# EAGLE design LTC3108breakoutDFN (EAGLE 5.10)
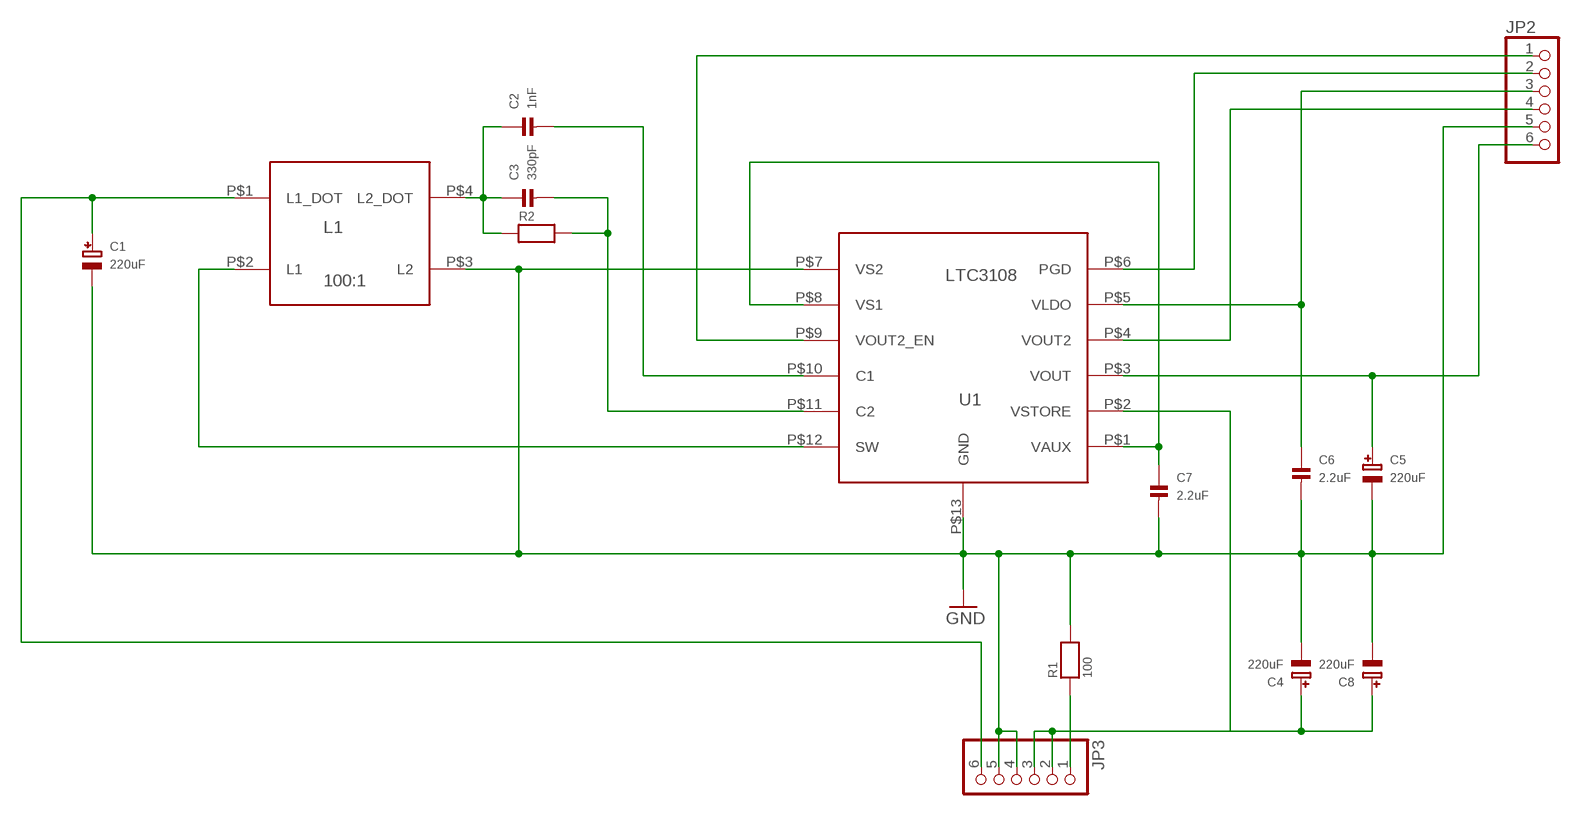
[diagram p0: schematic, sheet 1]

## Parts
C1  220uF  CAP_TANTALUMD/7343_REFLOW  [EIA7343-31/D-R]
C2  1nF  CAP_CERAMIC0603  [0603]
C3  330pF  CAP_CERAMIC0603  [0603]
C4  220uF  CAP_TANTALUMD/7343_REFLOW  [EIA7343-31/D-R]
C5  220uF  CAP_TANTALUMD/7343_REFLOW  [EIA7343-31/D-R]
C6  2.2uF  CAP_CERAMIC0603  [0603]
C7  2.2uF  CAP_CERAMIC0603  [0603]
C8  220uF  CAP_TANTALUMD/7343_REFLOW  [EIA7343-31/D-R]
JP2  HEADER-1X6ROUND  [1X06_ROUND]
JP3  HEADER-1X6ROUND  [1X06_ROUND]
L1  100:1  COILCRAFT_LPR6235-752SML  [COILCRAFT_LPR6235]
R1  100  RESISTOR0603  [0603]
R2  RESISTOR0603  [0603]
U1  LTC3108  [DFN_12]

## Nets
GND: C1.- C4.- C5.- C6.2 C7.2 C8.- JP2.5 JP3.4 JP3.5 L1.P$3(L2) R1.2 U1.P$7(VS2) U1.P$13(GND)
N$1: C1.+ JP3.6 L1.P$1(L1_DOT)
N$2: L1.P$2(L1) U1.P$12(SW)
N$3: C3.2 R2.2 U1.P$11(C2)
N$4: C2.2 U1.P$10(C1)
N$5: C2.1 C3.1 L1.P$4(L2_DOT) R2.1
N$6: C7.1 U1.P$1(VAUX) U1.P$8(VS1)
N$7: C4.+ C8.+ JP3.2 JP3.3 U1.P$2(VSTORE)
N$8: C5.+ JP2.6 U1.P$3(VOUT)
N$9: JP3.1 R1.1
N$10: C6.1 JP2.3 U1.P$5(VLDO)
N$11: JP2.1 U1.P$9(VOUT2_EN)
N$12: JP2.2 U1.P$6(PGD)
N$13: JP2.4 U1.P$4(VOUT2)

## Library data of the parts
C1 C4 C5 C8 = microbuilder:CAP_TANTALUM: Tantalum Capacitors Wave footprints have larger pads and are meant to be used for hand soldering. Reflow footprints are optimised for solder paste and a reflow oven. EIA3216-18/A-[R/W] - Size A / 3216-18 / 1206 footprint 4.7µF 25V 10% Tantalum Capacitor 10µF 16V 10% Tantalum Capacitor [Digikey: 495-2236-2-ND] EIA3528-21/B-[R/W] - Size B / 3528-21 47µF 10V 10% Tantalum Capactior [Digikey: 495-2216-1-ND] EIA6032-28/C-[R/W] - Size C / 6032-28 10µF 35V 20% Tantalum Capacitor [Digikey: 495-2285-1-ND] 100µF 16V 10% Tantalum Capactior [Digikey: 399-5214-1-ND]
C2 C3 C6 C7 = microbuilder:CAP_CERAMIC: Ceramic Capacitors 0402 - 0402 Surface Mount Capacitors 0.1uF 10V 10% [Digikey: 490-1318-2-ND] 0603 - 0603 Surface Mount Capacitors 16 pF 50V 5% [Digikey: 445-5051-2-ND] 22 pF 50V [Digikey: PCC220ACVTR-ND] 33 pF 50V 5% [Digikey: 490-1415-1-ND] 56pF 50V 5% [Digikey: 490-1421-1-ND] 220pF 50V 5% [Digikey: 445-1285-1-ND] 680 pF 50V 2200 pF 50V 5% C0G [Digikey: 445-1297-1-ND] 5600 pF 100V 5% X7R [Digikey: 478-3711-1-ND] 0.1 µF 25V 10% [Digikey: PCC2277TR-ND] 0.22 µF 16V 10% X7R [Digikey: 445-1318-1-ND] 1.0 µF 25V 10% [Digikey: 445-5146-2-ND] 0603 - RF Specific 3pF 250V +/-0.1pF RF [Digikey: 712-1347-1-ND] 18 pF 250V 5% [Digikey: 478-3505-1-ND or 712-1322-1-ND] 56 pF 250V 5% C0G RF [Digikey: 490-4867-1-ND] 68 pF 250V RF [Digikey: 490-4868-1-ND] 0805 - 0805 Surface Mount Capacitors 220 pF 250V 2% RF Ceramic Capacitor [Digikey: 712-1398-1-ND] 1000 pF 50V 2% NP0 Ceramic Capacitor [Digikey: 478-3760-1-ND] 0.1 µF 25V 10% Ceramic Capacitor [Digikey: PCC1828TR-ND] 1.0 µF 16V 10% Ceramic Capacitor[Digikey: 490-1691-2-ND] 10.0 µF 10V 10% Ceramic Capacitor[Digikey: 709-1228-1-ND] 1206 - 1206 Surface Mount Capacitors
JP2 JP3 = microbuilder:HEADER-1X6: PIN HEADER
L1 = wa7iut:COILCRAFT_LPR6235-752SML: Coil Craft LPR6235-752SML
R1 R2 = microbuilder:RESISTOR: Resistors 0402 - 0402 Surface Mount Package 10.0K 1% 1/16W [Digikey: 311-10.0KLRTR-ND] 0603 - 0603 Surface Mount Package 0 Ohm 1/10 Watt 1% Resistor 15 Ohm 1/10 Watt 1% Resistor 33 Ohm 1/10 Watt 1% Resistor 49.9 Ohm 1/10 Watt 1% Resistor 100 Ohm 1/10 Watt 1% Resistor 150 Ohm 1/10 Watt 1% Resistor 240 Ohm 1/10 Watt 1% Resistor 390 Ohm 1/10 Watt 1% Resistor 560 Ohm 1/10 Watt 1% Resistor 750 Ohm 1/10 Watt 1% Resistor 1.0K Ohm 1/10 Watt 1% Resistor 1.5K Ohm 1/10 Watt 1% Resistor 2.0K Ohm 1/10 Watt 1% Resistor 4.7K Ohm 1/10 Watt 1% Resistor 10.0K Ohm 1/10 Watt 1% Resistor 20.0K Ohm 1/10 Watt 1% Resistor 33.0K Ohm 1/10 Watt 1% Resistor 100.0K Ohm 1/10 Watt 1% Resistor 0805 - 0805 Surface Mount Package 0 Ohm 1/8 Watt 1% Resistor 33 Ohm 1/8 Watt 1% Resistor 100 Ohm 1/8 Watt 1% Resistor 150 Ohm 1/8 Watt 1% Resistor 200 Ohm 1/8 Watt 1% Resistor 240 Ohm 1/8 Watt 1% Resistor 330 Ohm 1/8 Watt 1% Resistor 390 Ohm 1/8 Watt 1% Resistor 470 Ohm 1/8 Watt 1% Resistor 1.0K Ohm 1/8 Watt 1% Resistor 1.5K Ohm 1/8 Watt 1% Resistor 2.0K Ohm 1/8 Watt 1% Resistor 4.7K Ohm 1/8 Watt 1% Resistor 5.1K Ohm 1/8 Watt 1% Resistor 5.6K Ohm 1/8 Watt 1% Resistor 10.0K Ohm 1/8 Watt 1% Resistor 22.0K Ohm 1/8 Watt 1% Resistor 33.0K Ohm 1/8 Watt 1% Resistor 100K Ohm 1/8 Watt 1% Resistor 1206 - 1206 Surface Mount Package
U1 = wa7iut:LTC3108: LTC3108 - Ultralow Voltage Step-Up Converter and Power Manager

## Board
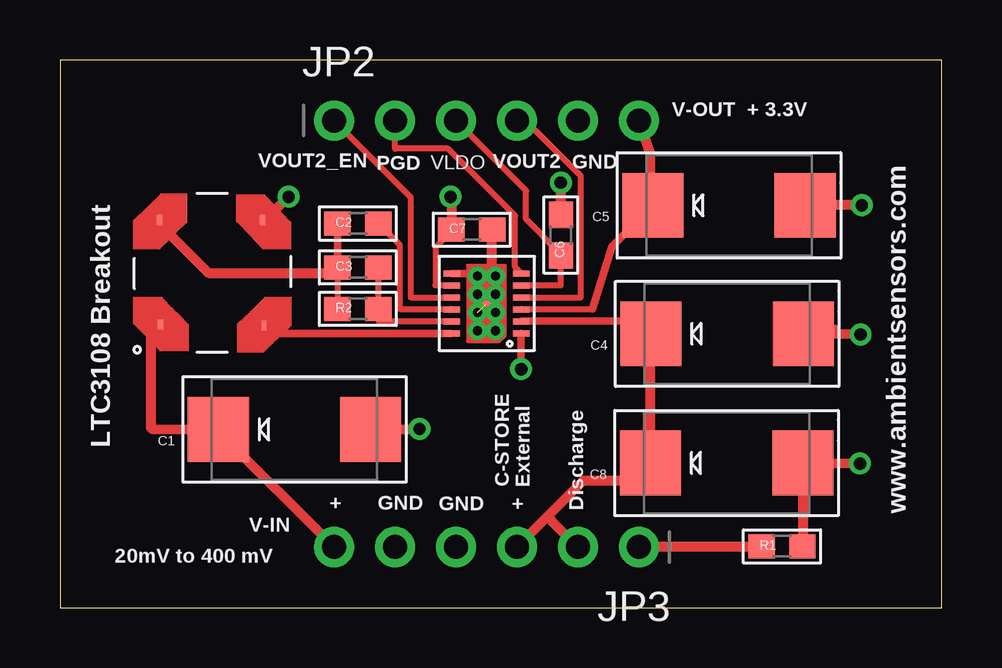
[diagram p1: board, top side]
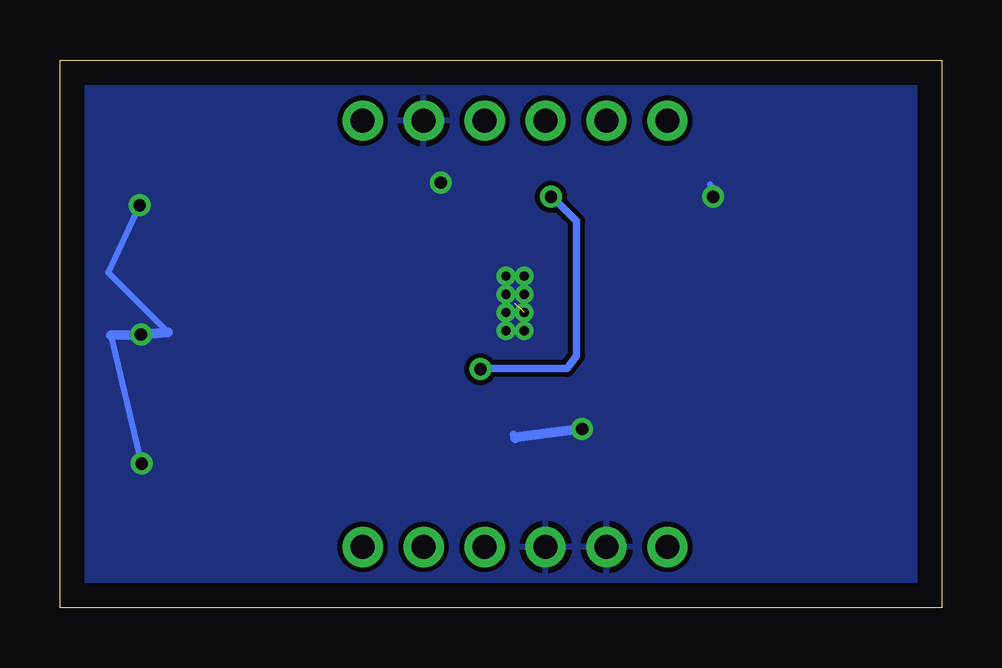
[diagram p2: board, bottom side, seen from below]

Size 36.75 x 22.85 mm. Coordinates in mm from the lower left corner, seen from the top.
Outline: 0,0 36.75,0 36.75,22.85 0,22.85 0,0
Copper layers (1*16): Top 0.035mm / dielectric 1.5mm / Bottom 0.035mm
Design rules "default": minimum track width 10mil, minimum drill 24mil, track to track 8mil, track to pad 8mil, pad to pad 8mil, via to via 8mil, smd to smd 8mil, copper to edge 40mil, drill to drill 8mil, minimum pad ring 10mil, minimum via ring 8mil, stop-mask expansion 4mil, vias tented up to drill 0mil, thermal gap 10mil

### Footprints (pad centres in the part's own frame; a part is rotated, then mirrored left to right if it is on the bottom)
EIA7343-31/D-R = smd 2.55 x 2.7: + 3.175,0; - -3.175,0
0603 = smd 1.1 x 1: 1 -0.85,0; 2 0.85,0
1X06_ROUND = drill 1 pad 1.676 round: 1 -6.35,0; 2 -3.81,0; 3 -1.27,0; 4 1.27,0; 5 3.81,0; 6 6.35,0
COILCRAFT_LPR6235 = smd 0.406 x 0.203: P$1 -2.15,2.15; P$2 -2.2,-2.15; P$3 2.2,-2.1; P$4 2.2,2.2
DFN_12 = smd 0.25 x 0.7: P$1 -1.25,-1.45; P$2 -0.75,-1.45; P$3 -0.25,-1.45; P$4 0.25,-1.445; P$5 0.75,-1.45; P$6 1.25,-1.45; P$7 1.25,1.45; P$8 0.75,1.45; P$9 0.25,1.45; P$10 -0.25,1.45; P$11 -0.75,1.45; P$12 -1.25,1.45; P$13 0,0

### Placement (x,y rotation side)
C1  9.78,7.44 180 top
C2  12.42,16.03 0 top
C3  12.42,14.2 0 top
C4  27.81,11.43 180 top
C5  27.89,16.79 180 top
C6  20.88,15.54 90 top
C7  17.17,15.77 0 top
C8  27.79,6.05 180 top
JP2  17.78,20.32 0 top
JP3  17.78,2.54 180 top
L1  6.35,13.97 90 top
R1  30.1,2.57 0 top
R2  12.42,12.47 0 top
U1  17.78,12.7 90 top

### Tracks (layer width: path | path; a pad name or v marks a point on that pad's centre or on a via)
GND  (via drill 0.38, 0.51)  (1 unrouted)
  Top 0.254: L1.P$3 8.55,16.17 | 17.29,13.95 v17.4,13.84 | v18.16,13.84 18.02,13.98 | v14.99,7.47 15.06,7.67 | 30.99,2.59 30.96,2.56 R1.2 | 30.99,5.84 C8.-
  Top 0.305: U1.P$7 17.29,13.95
  Top 0.406: 8.55,16.17 v9.53,17.14 | 18.02,13.98 C7.2 | C1.- v14.99,7.47 | C6.2 v20.88,17.73 | 32.31,11.61 C4.- v33.38,11.4 | C8.- v33.35,6.02 | v33.43,16.79 C5.- | 30.99,2.59 30.99,5.84
  Bottom 0.254: v9.53,17.14 9.53,17.53 9.65,17.65 | v33.35,6.02 34.62,11.38 | v33.43,16.79 34.75,13.99 32.26,11.51
  Bottom 0.305: 17.74,7.11 17.86,7.23
  Bottom 0.406: v14.99,7.47 17.74,7.11 17.78,7.07 | 34.62,11.38 v33.38,11.4 32.26,11.51
  other vias: 17.4,13.08 18.16,13.08 17.4,12.32 18.16,12.32 17.4,11.56 18.16,11.56
  pour Bottom: 0,22.86 0,0 36.83,0 36.83,22.86
N$1
  Top 0.254: C1.+ 6.71,7.26
  Top 0.406: L1.P$1 4.2,11.77 3.81,11.38 3.81,7.47 C1.+ | 6.71,7.26 JP3.6
N$2
  Top 0.254: L1.P$2 8.82,11.45
  Top 0.305: 8.82,11.45 U1.P$12
N$3
  Top 0.254: U1.P$11 16.31,11.96 13.28,11.96 13.28,12.47 R2.2 13.28,12.57 13.28,14.2 C3.2
N$4
  Top 0.254: U1.P$10 16.31,12.47 14.17,12.47 14.17,15.14 13.28,16.03 C2.2
N$5
  Top 0.254: R2.1 11.58,12.47 11.58,13.97 11.58,14.2 C3.1 11.58,14.3 11.58,16.03 C2.1
  Top 0.305: C2.1 11.57,14.19 11.58,13.97
  Top 0.406: 11.58,13.97 6.2,13.97 4.57,15.6 4.57,15.75 L1.P$4
N$6  (via drill 0.51)
  Top 0.254: U1.P$8 16.31,13.46 15.65,13.46 15.65,15.04 16.26,15.65 C7.1
  Top 0.305: v19.23,9.96 U1.P$1
  Top 0.406: C7.1 16.32,16.88 v16.28,17.14
  Bottom 0.305: v16.28,17.14 15.98,16.89 15.21,16.13 15.21,10.52 15.62,9.98 19.1,9.98 v19.23,9.96
N$7
  Top 0.254: 24.64,11.96 C4.+ 24.61,11.33 | 19.25,11.96 U1.P$2 | C8.+ 24.51,5.97 | 24.43,5.38 24.43,5.87 C8.+ | 24.33,5.31 C8.+ | 20.47,3.66 20.47,3.68 20.33,3.82
  Top 0.305: 24.64,11.96 19.25,11.96
  Top 0.406: C8.+ 24.61,11.33 | JP3.3 20.33,3.82 21.82,5.31 24.33,5.31 | 20.47,3.66 JP3.2
N$8
  Top 0.254: C5.+ 24.64,16.89 | C5.+ 24.61,17.02 | 22.2,12.47 19.25,12.47 U1.P$3 | 24.64,16.69 C5.+
  Top 0.305: 22.2,12.47 23.01,15.06 24.64,16.69
  Top 0.406: JP2.6 24.61,18.92 24.61,17.02
N$9
  Top 0.254: JP3.1 24.13,2.56
  Top 0.406: 24.13,2.56 R1.1
N$10
  Top 0.254: U1.P$5 19.25,13.46 20.88,13.46 C6.1 20.83,14.81 19.43,16.2 19.43,17.4 JP2.3
N$11
  Top 0.254: JP2.1 14.63,17.12 14.63,12.95 16.31,12.95 U1.P$9
N$12
  Top 0.254: JP2.2 13.97,19.15 16.18,19.15 18.97,16.36 18.97,14.22 19.23,13.97 U1.P$6
N$13
  Top 0.254: JP2.4 19.41,20.32 21.72,18.01 21.72,12.95 U1.P$4

### Text on the board
tPlace: V-OUT + 3.3V | VOUT2_EN | PGD | VLDO | VOUT2 | GND | LTC3108 Breakout | C-STORE | External | + | GND | GND | + | Discharge | www.ambientsensors.com | V-IN | 20mV to 400 mV